# Altium schematic sheet RadioCommunication.SchDoc: Radio Communication
size A4; Date: 2022 Fall; Address1: LK Bulls; Address2: Bagoly Zoltan; Address3: Feher Daniel; Address4: G. Varga Gabor; DocumentNumber: 12; Revision: 1.0; SheetNumber: 12; SheetTotal: 14
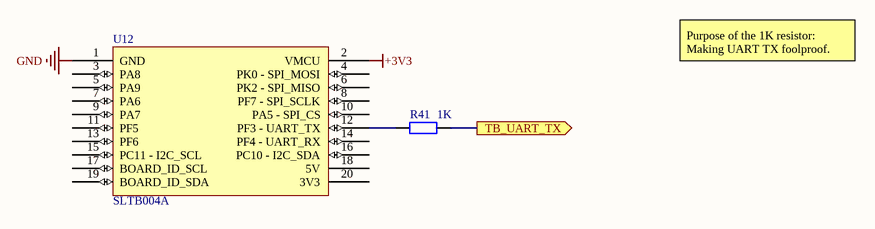
[diagram p0: RadioCommunication.SchDoc]

## Parts
R41  1K  [FP_0805_RES]
U12  SLTB004A  [SLTB004A]

## Ports
TB_UART_TX (out)

## Nets
+3V3: U12.2(VMCU)
GND: U12.1(GND)
TB_UART_TX: R41.2 ; port TB_UART_TX
NetR41_1: R41.1 U12.12(PF3_-_UART_TX)

Not connected (* = marked no-connect by the designer): U12 3(PA8) 4(PK0_-_SPI_MOSI) 5(PA9) 6(PK2_-_SPI_MISO) 7(PA6) 8(PF7_-_SPI_SCLK) 9(PA7) 10(PA5_-_SPI_CS) 11(PF5) 13(PF6) 14(PF4_-_UART_RX) 15(PC11_-_I2C_SCL) 16(PC10_-_I2C_SDA) 17(BOARD_ID_SCL) 18(5V) 19(BOARD_ID_SDA) 20(3V3)

## Notes on the sheet
- Purpose of the 1K resistor: Making UART TX foolproof.
- Title
- Size:
- Date:
- A4
- Number:
- Revision:
- Sheet
- of
- Designed by:
- File:

## Library data of the parts
R41 = RES: Resistor; Tolerance: 5%; Power: 0.125W; Name: 1K00 0805 5% CR-05JL7----1K 0.125W (VIK); Supplier: Lomex; Reference: 81-10-87; Value: 1K
U12 = SLTB004A: SiLabs Thunderboard Sense 2 module; Name: HÜVELY 20 P FHSH-2.54-20 (T-T) 1# h=8,5mm AU; Supplier: Lomex; Reference: 43-00-08